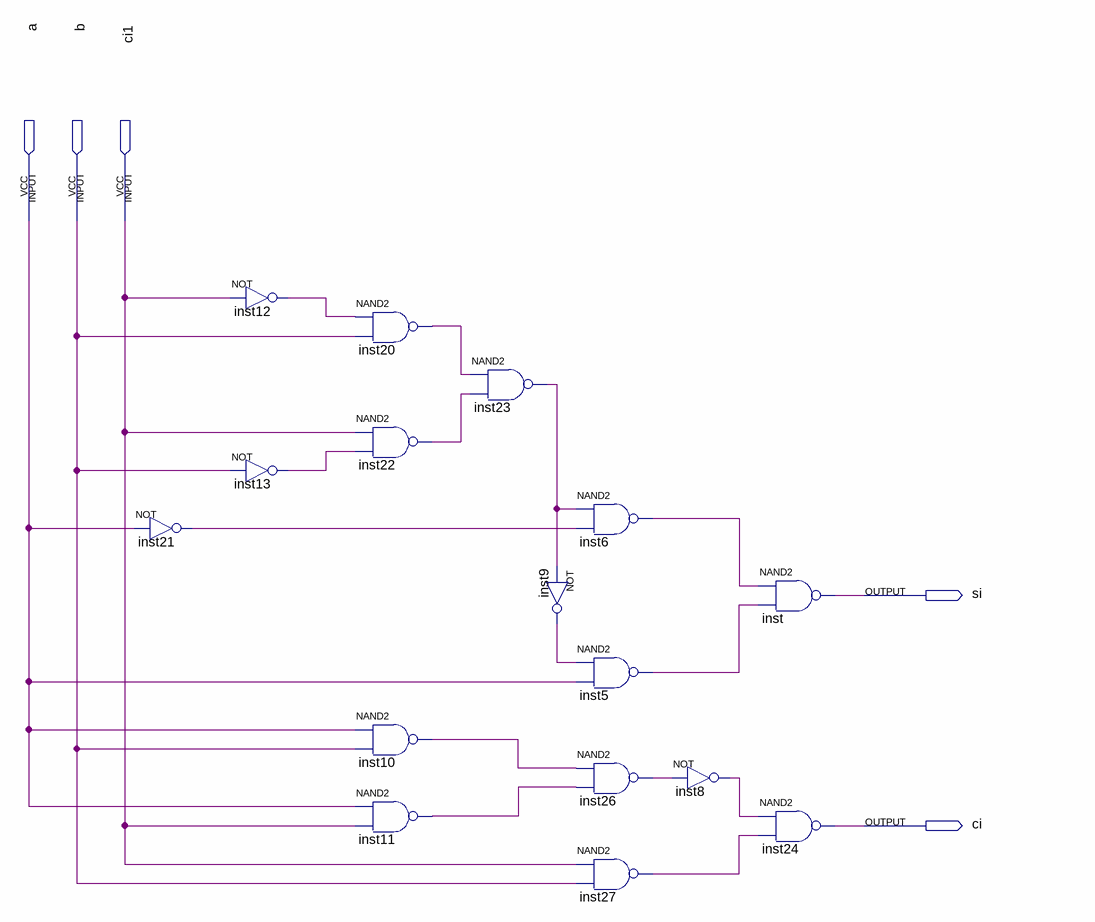
[diagram p0: schematic sheet]
// Quartus schematic Problema54.bdf as structural Verilog: 16 symbols, 5 pins
module Problema54 (
  input  a,
  input  b,
  input  ci1,
  output si,
  output ci
);

  wire inst5_out, inst6_out, inst8_out, inst9_out, inst10_out, inst11_out, inst12_out, inst13_out,
       inst20_out, inst21_out, inst22_out, inst23_out, inst26_out, inst27_out;

  not inst21 (inst21_out, a);
  not inst12 (inst12_out, ci1);
  not inst13 (inst13_out, b);
  nand inst20 (inst20_out, inst12_out, b);
  nand inst22 (inst22_out, ci1, inst13_out);
  nand inst10 (inst10_out, a, b);
  nand inst11 (inst11_out, a, ci1);
  nand inst23 (inst23_out, inst20_out, inst22_out);
  not inst9 (inst9_out, inst23_out);
  nand inst6 (inst6_out, inst23_out, inst21_out);
  nand inst5 (inst5_out, inst9_out, a);
  nand inst26 (inst26_out, inst10_out, inst11_out);
  nand inst27 (inst27_out, ci1, b);
  not inst8 (inst8_out, inst26_out);
  nand inst (si, inst6_out, inst5_out);
  nand inst24 (ci, inst8_out, inst27_out);
endmodule
